# Altium project OrangePi_Zero2.PrjPcb
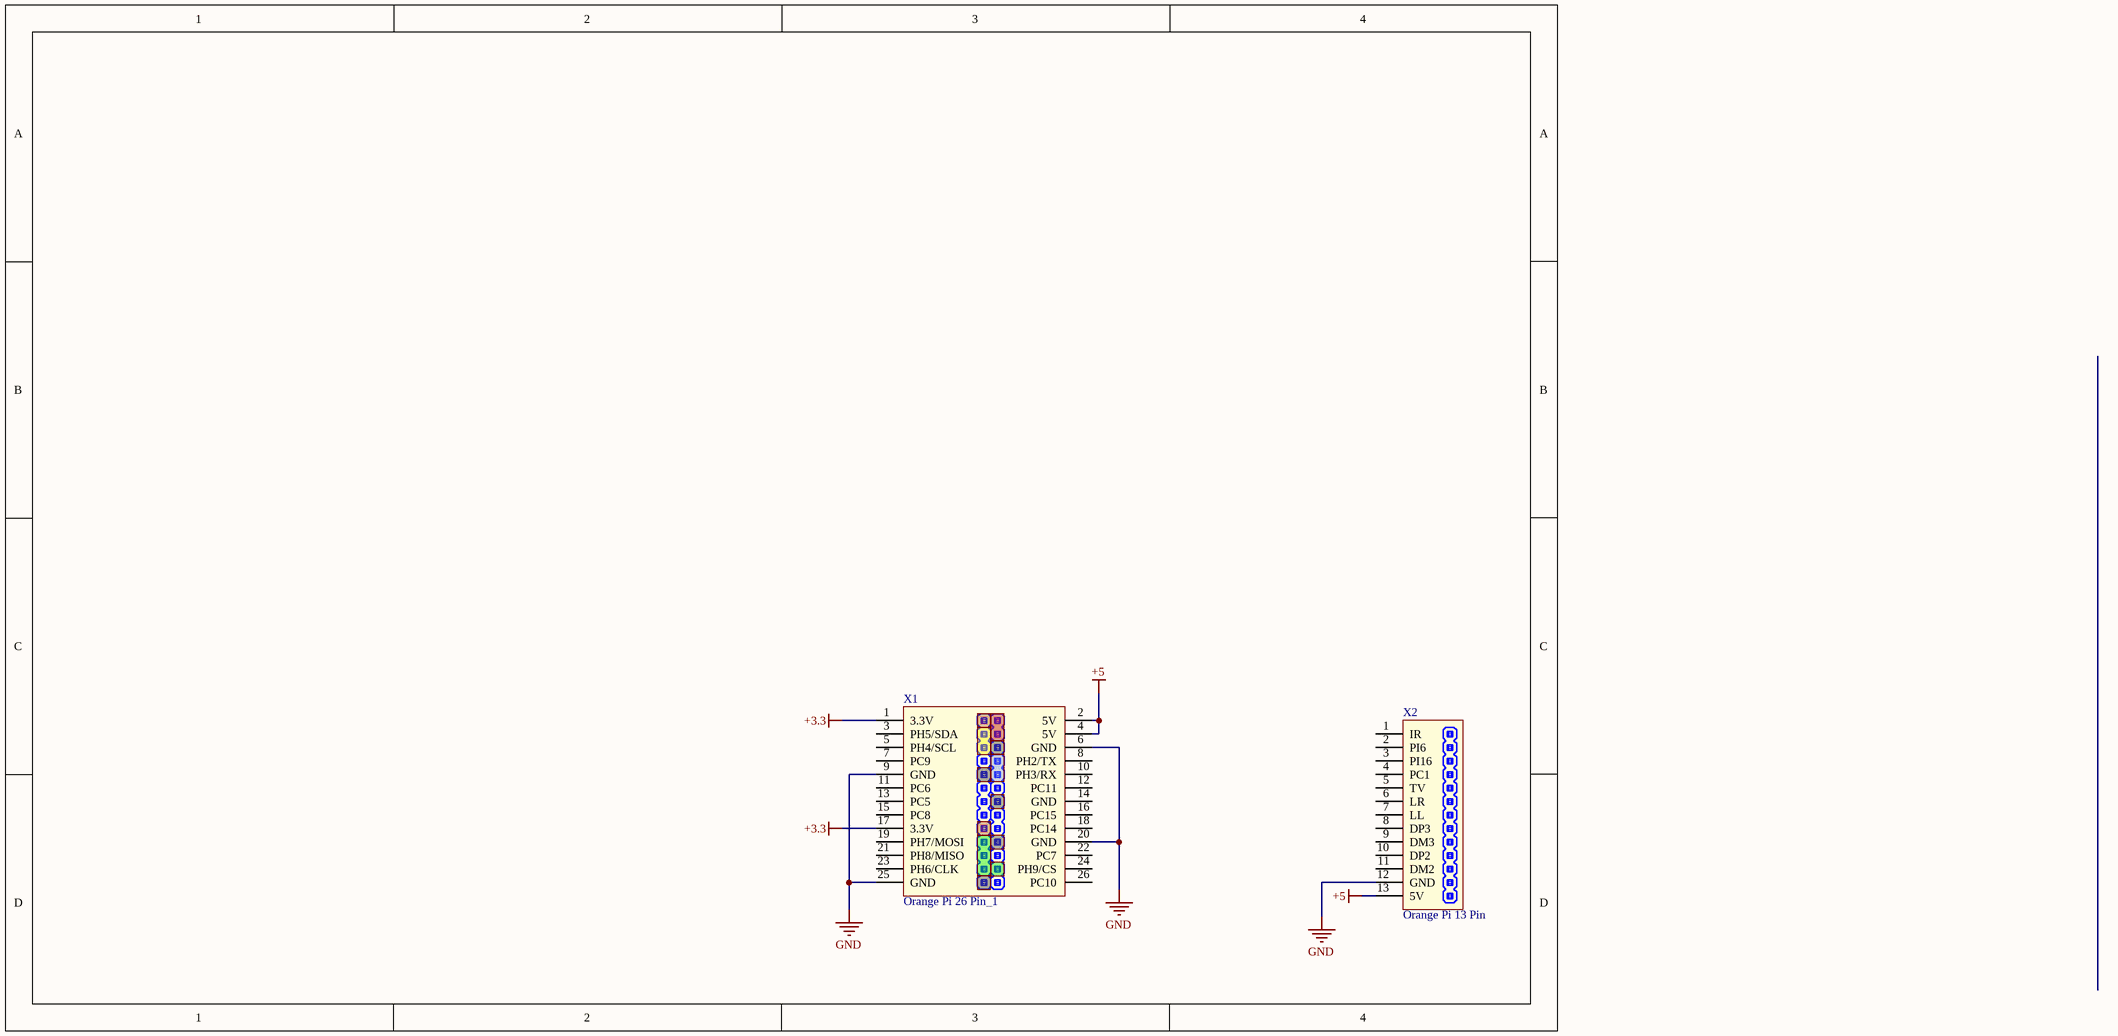
[diagram p0: OrangePi_Zero2.SchDoc]
1 sheet, 2 parts. Net scope: global (net labels, ports and power ports of the same name join across sheets).
Board file: OrangePi_Zero2.PcbDoc

## Sheet OrangePi_Zero2.SchDoc
size A4

### Parts
X1  Orange Pi 26 Pin_1  [26pin Orange Pi Bottom]
X2  Orange Pi 13 Pin  [13pin Orange Pi]

### Nets
+3.3: X1.1(3.3V) X1.17(3.3V)
+5: X1.2(5V) X1.4(5V) X2.13(5V)
GND: X1.6(GND) X1.9(GND) X1.20(GND) X1.25(GND) X2.12(GND)

Not connected (* = marked no-connect by the designer): X1 3(PH5/SDA) 5(PH4/SCL) 7(PC9) 8(PH2/TX) 10(PH3/RX) 11(PC6) 12(PC11) 13(PC5) 14(GND) 15(PC8) 16(PC15) 18(PC14) 19(PH7/MOSI) 21(PH8/MISO) 22(PC7) 23(PH6/CLK) 24(PH9/CS) 26(PC10); X2 1(IR) 2(PI6) 3(PI16) 4(PC1) 5(TV) 6(LR) 7(LL) 8(DP3) 9(DM3) 10(DP2) 11(DM2)